# Altium schematic sheet LPCB235 - RM48 - EMIF.SchDoc
size A3; Address1: Unit 4; DocumentNumber: 26; Revision: 2; SheetNumber: 26; SheetTotal: 37; Lockie__PCB_SUB_ASSEMBLY: EMIF; Lockie__PCB_ASSEMBLY: FCU PCB; Lockie__LDL: LPCB235; Lockie__PCB_DESCRIPTION: Flight Control Unit
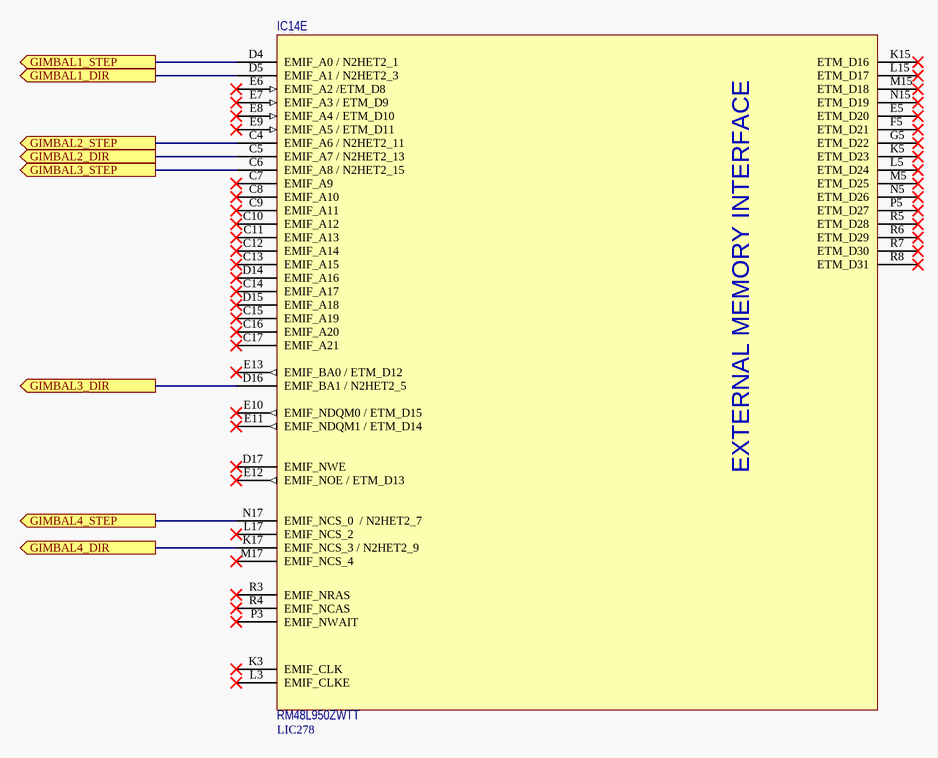
[diagram p0: LPCB235 - RM48 - EMIF.SchDoc]

## Parts
IC14  RM48L950ZWTT  LDL_NUMBER: LIC278  [LFP054__ZWT (S-PBGA-N337)]  (part E of 10)

## Ports
GIMBAL1_DIR (out), GIMBAL1_STEP (out), GIMBAL2_DIR (out), GIMBAL2_STEP (out), GIMBAL3_DIR (out), GIMBAL3_STEP (out), GIMBAL4_DIR (out), GIMBAL4_STEP (out)

## Nets
GIMBAL1_DIR: IC14.D5(EMIF_A1_/_N2HET2_3) ; port GIMBAL1_DIR
GIMBAL1_STEP: IC14.D4(EMIF_A0_/_N2HET2_1) ; port GIMBAL1_STEP
GIMBAL2_DIR: IC14.C5(EMIF_A7_/_N2HET2_13) ; port GIMBAL2_DIR
GIMBAL2_STEP: IC14.C4(EMIF_A6_/_N2HET2_11) ; port GIMBAL2_STEP
GIMBAL3_DIR: IC14.D16(EMIF_BA1_/_N2HET2_5) ; port GIMBAL3_DIR
GIMBAL3_STEP: IC14.C6(EMIF_A8_/_N2HET2_15) ; port GIMBAL3_STEP
GIMBAL4_DIR: IC14.K17(EMIF_NCS_3_/_N2HET2_9) ; port GIMBAL4_DIR
GIMBAL4_STEP: IC14.N17(EMIF_NCS_0__/_N2HET2_7) ; port GIMBAL4_STEP

Not connected (* = marked no-connect by the designer): IC14 C7(EMIF_A9)* C8(EMIF_A10)* C9(EMIF_A11)* C10(EMIF_A12)* C11(EMIF_A13)* C12(EMIF_A14)* C13(EMIF_A15)* C14(EMIF_A17)* C15(EMIF_A19)* C16(EMIF_A20)* C17(EMIF_A21)* D14(EMIF_A16)* D15(EMIF_A18)* D17(EMIF_NWE)* E5(ETM_D20)* E6(EMIF_A2_/ETM_D8)* E7(EMIF_A3_/_ETM_D9)* E8(EMIF_A4_/_ETM_D10)* E9(EMIF_A5_/_ETM_D11)* E10(EMIF_NDQM0_/_ETM_D15)* E11(EMIF_NDQM1_/_ETM_D14)* E12(EMIF_NOE_/_ETM_D13)* E13(EMIF_BA0_/_ETM_D12)* F5(ETM_D21)* G5(ETM_D22)* K3(EMIF_CLK)* K5(ETM_D23)* K15(ETM_D16)* L3(EMIF_CLKE)* L5(ETM_D24)* L15(ETM_D17)* L17(EMIF_NCS_2)* M5(ETM_D25)* M15(ETM_D18)* M17(EMIF_NCS_4)* N5(ETM_D26)* N15(ETM_D19)* P3(EMIF_NWAIT)* P5(ETM_D27)* R3(EMIF_NRAS)* R4(EMIF_NCAS)* R5(ETM_D28)* R6(ETM_D29)* R7(ETM_D30)* R8(ETM_D31)*

## Notes on the sheet
- PCB COMPONENT DESCRIPTION
- LDL NUMBER
- Assembly Details
- Size
- Drawing File Name
- Revision
- http://rloop.org
- Scale
- A3
- Sheet Details
- N.T.S
- Sheet:
- Of:
- (in symbol RM48L950ZWTT, part E) EXTERNAL MEMORY INTERFACE

## Library data of the parts
IC14 = RM48L950ZWTT: IC, CPU, RM48 Safety CPU, SMD NFBGA337 [LIC278]; FMEDA__FUNCTION_IN_SYSTEM: SAFETY CPU 1; FMEDA__OPERATING__TEMP_MIN: -20; FMEDA__OPERATING__TEMP_TYP: 27; FMEDA__OPERATING__TEMP_MAX: 50; FMEDA__CHANNEL: COM